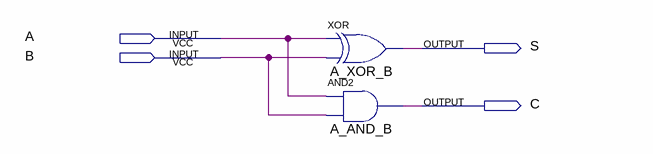
[diagram p0: schematic sheet]
// Quartus schematic HA.bdf as structural Verilog: 2 symbols, 4 pins
module HA (
  input  A,
  input  B,
  output S,
  output C
);

  xor A_XOR_B (S, A, B);
  and A_AND_B (C, A, B);
endmodule
